# Altium schematic sheet H_Bridge_Driver.SchDoc
size 420 x 297 mm; DocumentNumber: Введите номер платы + Э3; SheetNumber: 4; Format: A3
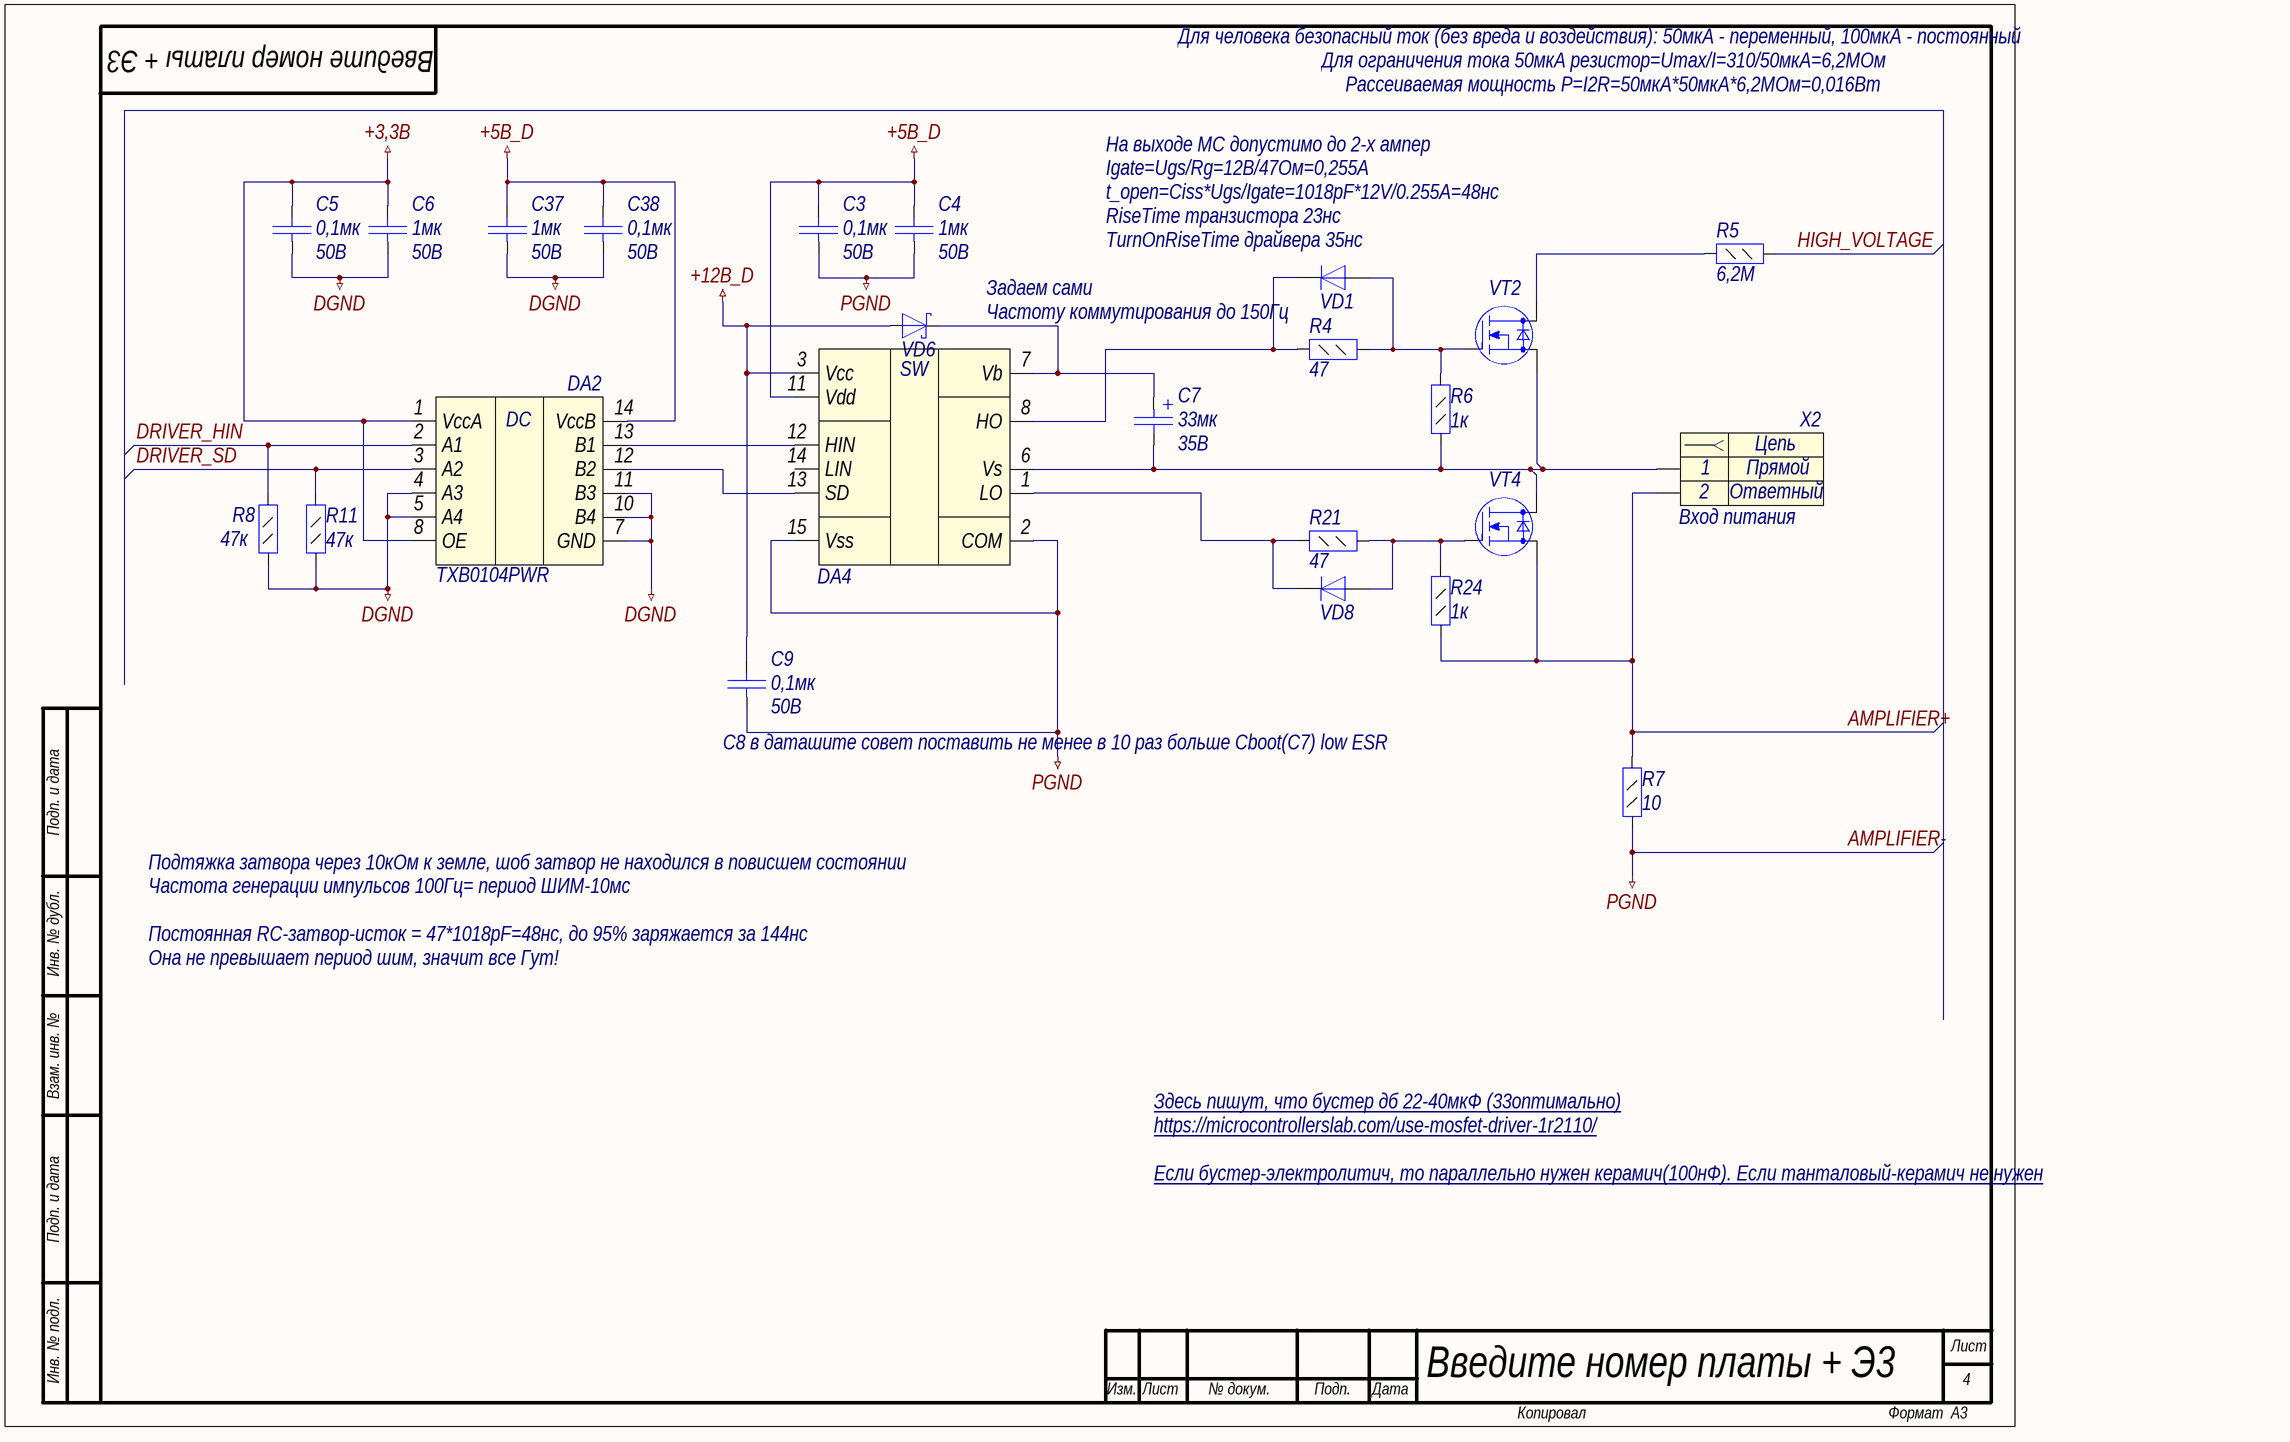
[diagram p0: H_Bridge_Driver.SchDoc]

## Parts
C3  value 0,1мк  Voltage: 50В  [C0805]  (hidden comment: Capacitor)
C4  value 1мк  Voltage: 50B  [C0805]  (hidden comment: Capacitor)
C5  value 0,1мк  Voltage: 50В  [C0805]  (hidden comment: Capacitor)
C6  value 1мк  Voltage: 50B  [C0805]  (hidden comment: Capacitor)
C7  value 33мк  Voltage: 35В  [TANTAL CASE D]  (hidden comment: Capacitor_pol)
C9  value 0,1мк  Voltage: 50В  [C0805]  (hidden comment: Capacitor)
C37  value 1мк  Voltage: 50B  [C0805]  (hidden comment: Capacitor)
C38  value 0,1мк  Voltage: 50В  [C0805]  (hidden comment: Capacitor)
DA2  Part Number: TXB0104PWR  [TSSOP14]  (hidden comment: TXB0104)
DA4  IR2110S  [SO16]  (value not drawn)
R4  value 47  [R0805]  (hidden comment: Resistor_0,125Вт)
R5  value 6,2М  [R0805]  (hidden comment: Resistor_0,125Вт)
R6  value 1к  [R0805]  (hidden comment: Resistor_0,125Вт)
R7  value 10  [R0805]  (hidden comment: Resistor_0,125Вт)
R8  value 47к  [R0805]  (hidden comment: Resistor_0,125Вт)
R11  value 47к  [R0805]  (hidden comment: Resistor_0,125Вт)
R21  value 47  [R1206]  (hidden comment: Resistor_0,25Вт)
R24  value 1к  [R0805]  (hidden comment: Resistor_0,125Вт)
VD1  Diode  [SMA]  (value not drawn)
VD6  DiodeSchottky  [SMA]  (value not drawn)
VD8  Diode  [SMA]  (value not drawn)
VT2  N-MOSFET  [D2PAK]  (value not drawn)
VT4  N-MOSFET  [D2PAK]  (value not drawn)
X2  Вход питания  [CWF-2R]

## Nets
+3,3В: C5.2 C6.2 DA2.1(VccA) DA2.8(OE)
+5B_D: C3.2 C4.2 C37.2 C38.2 DA2.14(VccB) DA4.11(Vdd)
+12В_D: C9.2 DA4.3(Vcc) VD6.2(A)
AMPLIFIER-: C3.1 C4.1 C9.1 DA4.2(COM) DA4.15(Vss) R7.1  [also labelled PGND]
DGND: C5.1 C6.1 C37.1 C38.1 DA2.4(A3) DA2.5(A4) DA2.7(GND) DA2.10(B4) DA2.11(B3) R8.1 R11.1
AMPLIFIER+: R7.2 R24.1 VT4.3(S) X2.2
DRIVER_HIN: DA2.2(A1) R8.2
DRIVER_SD: DA2.3(A2) R11.2
HIGH_VOLTAGE: R5.2
NetC7_1: C7.1 DA4.7(Vb) VD6.1(K)
NetC7_2: C7.2 DA4.6(Vs) R6.1 VT2.3(S) VT4.2(D) X2.1
NetDA2_12: DA2.12(B2) DA4.13(SD)
NetDA2_13: DA2.13(B1) DA4.12(HIN)
NetDA4_1: DA4.1(LO) R21.1 VD8.1(K)
NetDA4_8: DA4.8(HO) R4.1 VD1.1(K)
NetR4_2: R4.2 R6.2 VD1.2(A) VT2.1(G)
NetR5_1: R5.1 VT2.2(D)
NetR21_2: R21.2 R24.2 VD8.2(A) VT4.1(G)

Not connected (* = marked no-connect by the designer): DA4 14(LIN)

## Notes on the sheet
- Для человека безопасный ток (без вреда и воздействия): 50мкА - переменный, 100мкА - постоянный
- Для ограничения тока 50мкА резистор=Umax/I=310/50мкA=6,2МОм
- Рассеиваемая мощность P=I2R=50мкA*50мкA*6,2МОм=0,016Вт
- На выходе МС допустимо до 2-х ампер
- Igate=Ugs/Rg=12В/47Ом=0,255А
- t_open=Ciss*Ugs/Igate=1018pF*12V/0.255A=48нс
- (near VD1) RiseTime транзистора 23нс
- Задаем сами
- (near VD1) TurnOnRiseTime драйвера 35нс
- Частоту коммутирования до 150Гц
- (near C9) C8 в даташите совет поставить не менее в 10 раз больше Cboot(C7) low ESR
- Подп. и дата
- Подтяжка затвора через 10кОм к земле, шоб затвор не находился в повисшем состоянии
- Частота генерации импульсов 100Гц= период ШИМ-10мс
- Инв. № дубл.
- Постоянная RC-затвор-исток = 47*1018pF=48нс, до 95% заряжается за 144нс
- Она не превышает период шим, значит все Гут!
- Взам. инв. №
- https://microcontrollerslab.com/use-mosfet-driver-1r2110/
- Здесь пишут, что бустер дб 22-40мкФ (33оптимально)
- Если бустер-электролитич, то параллельно нужен керамич(100нФ). Если танталовый-керамич не нужен
- Инв. № подл.
- Лист
- Изм.
- № докум.
- Подп.
- Дата
- Копировал
- Формат
- (in symbol connect7) Цепь
- (in symbol driver23) SW
- (in symbol pwr48) DC

## Library data of the parts
C3 C5 C9 C38 = cap160: Конденсатор; Part Name: Ceramic; Manufacture: Murata; Part Number: GRM21BR71H104KA01L; id: cap160; TKE: X7R
C4 C6 C37 = cap151: Конденсатор; Part Name: Ceramic; Manufacture: Murata; Part Number: GRM21BR71H105K; id: cap151; TKE: X7R
C7 = cap259: Конденсатор полярный; Part Name: Tantal; Manufacture: AVX; Part Number: TAJD336K035RNJ; id: cap259
DA2 = pwr48: 4-Bit Bidirectional Voltage-level Translator; Part Name: 4 4-Bit Bidirectional Voltage-level Translator; Manufacturer: Texas Instruments; id: pwr48; Input Voltage: 1,2-3,6B; Output Voltage: 1,65-5,5B; Current: 50mA; Type: Isolated
DA4 = driver23: High and Low Side Driver; Manufacture: International Rectifier; Part Number: IR2110STRPBF; Logic High: 3-20B; Logic Low: 1,5-8B; Min Operating Supply Voltage: 10B; Max Operating Supply Voltage: 20B; Maximum output current: 2,5A; id: driver23; Part Name: High and Low side Driver
R4 = res41: Резистор; Manufacture: Yageo; Part Number: RC0805FR-0747RL; id: res41; Accuracy: 0.01; Part Name: Resistor; Power: 0,125Вт
R5 = res164: Резистор; Manufacture: Yageo; Part Number: RC0805FR-076M2; id: res164; Accuracy: 0.01; Part Name: Resistor; Power: 0,125Вт
R6 R24 = res73: Резистор; Manufacture: Yageo; Part Number: RC0805FR-071KL; id: res73; Accuracy: 0.01; Part Name: Resistor; Power: 0,125Вт
R7 = res25: Резистор; Manufacture: Yageo; Part Number: RC0805FR-0710RL; id: res25; Accuracy: 0.01; Part Name: Resistor; Power: 0,125Вт
R8 R11 = res113: Резистор; Manufacture: Yageo; Part Number: RC0805FR-0747KL; id: res113; Accuracy: 0.01; Part Name: Resistor; Power: 0,125Вт
R21 = res41: Резистор; Manufacture: Yageo; Part Number: RC0805FR-0747RL; id: res41; Accuracy: 0.01; Power: 0,125Вт; Part Name: Resistor
VD1 VD8 = diode21: Диод; Part Number: SMA4007; Manufacture: Wing Shing; Max Reverse Voltage: 1000B; Forward Voltage: 1,1B; Forward Current: 1A; Reverse Recovery time: 18ns; Capacitance: 12pF; Number of Channels: 1; id: diode21; Part Name: Diode
VD6 = diode1: Диод Шоттки; Part Number: SK34A; Manufacture: Taiwan Semiconductor; id: diode1; Max Reverse Voltage: 40B; Forward Voltage: 0,55B; Forward Current: 3A; Part Name: Diode Schottky
VT2 VT4 = trans10: Part Number: IRF840ASPBF; Manufacturer: Vishay; Structure: n-channel; V drain-source max: 500B; Rds: 0,85Ohm; Gate-to-source voltage: (+-)30B; Continuous drain current: 8A; Pulsed drain current: 32A; Power dissipation: 125W; id: trans10
X2 = connect7: Разъем - 2 конт. розетка; Part Name: CWF-2R type A; Part Number: DS1069-2 MR-A; Manufacture: Ningbo connfly electronic; Contact_1: Прямой; Contact_2: Ответный; Etch: 2,5mm; id: connect7